# Altium schematic sheet Ch5and6.SchDoc
size A
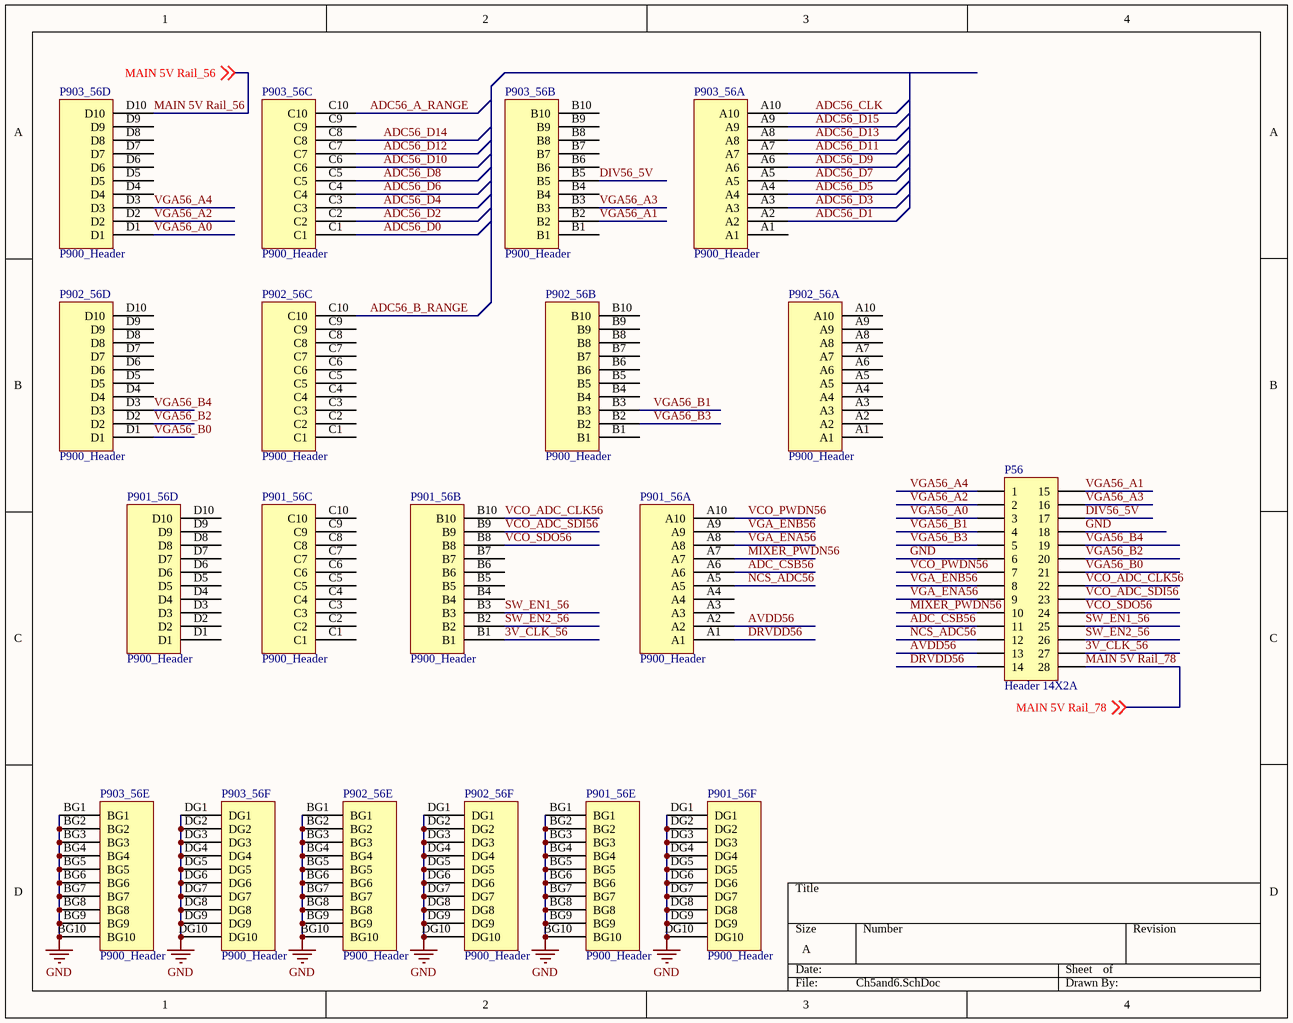
[diagram p0: Ch5and6.SchDoc]

## Parts
P56  Header 14X2A  [HDR2X14_CEN]
P901_56  P900_Header  [P900_header]  (parts A,B,C,D,E,F of 6)
P902_56  P900_Header  [P900_header]  (parts A,B,C,D,E,F of 6)
P903_56  P900_Header  [P900_header]  (parts A,B,C,D,E,F of 6)

## Nets
GND: P56.6 P56.18 P901_56.BG1 P901_56.BG2 P901_56.BG3 P901_56.BG4 P901_56.BG5 P901_56.BG6 P901_56.BG7 P901_56.BG8 P901_56.BG9 P901_56.BG10 P901_56.DG1 P901_56.DG2 P901_56.DG3 P901_56.DG4 P901_56.DG5 P901_56.DG6 P901_56.DG7 P901_56.DG8 P901_56.DG9 P901_56.DG10 P902_56.BG1 P902_56.BG2 P902_56.BG3 P902_56.BG4 P902_56.BG5 P902_56.BG6 P902_56.BG7 P902_56.BG8 P902_56.BG9 P902_56.BG10 P902_56.DG1 P902_56.DG2 P902_56.DG3 P902_56.DG4 P902_56.DG5 P902_56.DG6 P902_56.DG7 P902_56.DG8 P902_56.DG9 P902_56.DG10 P903_56.BG1 P903_56.BG2 P903_56.BG3 P903_56.BG4 P903_56.BG5 P903_56.BG6 P903_56.BG7 P903_56.BG8 P903_56.BG9 P903_56.BG10 P903_56.DG1 P903_56.DG2 P903_56.DG3 P903_56.DG4 P903_56.DG5 P903_56.DG6 P903_56.DG7 P903_56.DG8 P903_56.DG9 P903_56.DG10
3V_CLK_56: P56.27 P901_56.B1
ADC56_A_RANGE: P903_56.C10
ADC56_B_RANGE: P902_56.C10
ADC56_CLK: P903_56.A10
ADC56_D0: P903_56.C1
ADC56_D1: P903_56.A2
ADC56_D2: P903_56.C2
ADC56_D3: P903_56.A3
ADC56_D4: P903_56.C3
ADC56_D5: P903_56.A4
ADC56_D6: P903_56.C4
ADC56_D7: P903_56.A5
ADC56_D8: P903_56.C5
ADC56_D9: P903_56.A6
ADC56_D10: P903_56.C6
ADC56_D11: P903_56.A7
ADC56_D12: P903_56.C7
ADC56_D13: P903_56.A8
ADC56_D14: P903_56.C8
ADC56_D15: P903_56.A9
ADC_CSB56: P56.11 P901_56.A6
AVDD56: P56.13 P901_56.A2
DIV56_5V: P56.17 P903_56.B5
DRVDD56: P56.14 P901_56.A1
MAIN 5V Rail_56: P903_56.D10 ; off-sheet MAIN 5V Rail_56
MAIN 5V Rail_78: P56.28 ; off-sheet MAIN 5V Rail_78
MIXER_PWDN56: P56.10 P901_56.A7
NCS_ADC56: P56.12 P901_56.A5
SW_EN1_56: P56.25 P901_56.B3
SW_EN2_56: P56.26 P901_56.B2
VCO_ADC_CLK56: P56.22 P901_56.B10
VCO_ADC_SDI56: P56.23 P901_56.B9
VCO_PWDN56: P56.7 P901_56.A10
VCO_SDO56: P56.24 P901_56.B8
VGA56_A0: P56.3 P903_56.D1
VGA56_A1: P56.15 P903_56.B2
VGA56_A2: P56.2 P903_56.D2
VGA56_A3: P56.16 P903_56.B3
VGA56_A4: P56.1 P903_56.D3
VGA56_B0: P56.21 P902_56.D1
VGA56_B1: P56.4 P902_56.B3
VGA56_B2: P56.20 P902_56.D2
VGA56_B3: P56.5 P902_56.B2
VGA56_B4: P56.19 P902_56.D3
VGA_ENA56: P56.9 P901_56.A8
VGA_ENB56: P56.8 P901_56.A9

Not connected (* = marked no-connect by the designer): P901_56 A3 A4 B4 B5 B6 B7 C1 C2 C3 C4 C5 C6 C7 C8 C9 C10 D1 D2 D3 D4 D5 D6 D7 D8 D9 D10; P902_56 A1 A2 A3 A4 A5 A6 A7 A8 A9 A10 B1 B4 B5 B6 B7 B8 B9 B10 C1 C2 C3 C4 C5 C6 C7 C8 C9 D4 D5 D6 D7 D8 D9 D10; P903_56 A1 B1 B4 B6 B7 B8 B9 B10 C9 D4 D5 D6 D7 D8 D9

## Library data of the parts
P56 = Header 14X2A: Header, 14-Pin, Dual row; LatestRevisionDate: 17-Jul-2002; LatestRevisionNote: Re-released for DXP Platform.; Publisher: Altium Limited
P902_56 P903_56 = P900_Header: pin to pad: A1>ADC